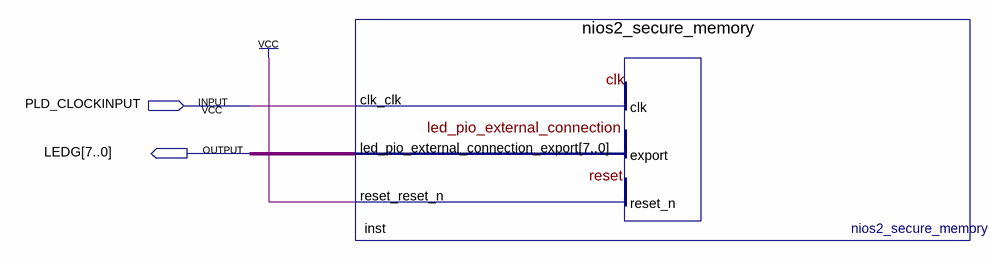
[diagram p0: schematic sheet]
// Quartus schematic nio2_secure_memory.bdf as structural Verilog: 1 symbols, 2 pins
module nio2_secure_memory (
  input  PLD_CLOCKINPUT,
  output [7:0] LEDG
);

  nios2_secure_memory inst (.clk_clk(PLD_CLOCKINPUT), .reset_reset_n(1'b1), .led_pio_external_connection_export(LEDG));
endmodule
